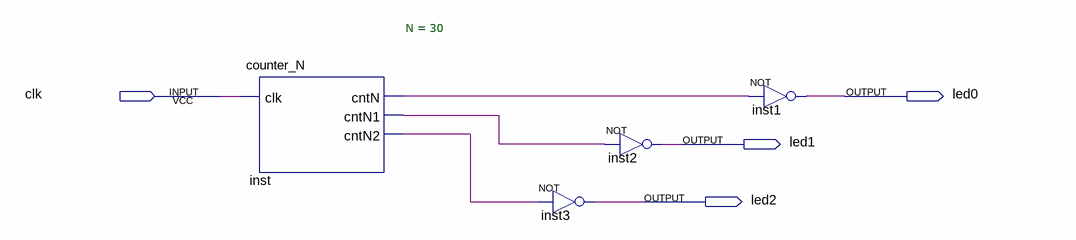
[diagram p0: schematic sheet]
// Quartus schematic test_counter_N_led0.bdf as structural Verilog: 4 symbols, 4 pins
module test_counter_N_led0 (
  input  clk,
  output led0,
  output led1,
  output led2
);

  wire inst_cntn, inst_cntn1, inst_cntn2;

  counter_N #(.N(30)) inst (.clk(clk), .cntN(inst_cntn), .cntN1(inst_cntn1), .cntN2(inst_cntn2));
  not inst3 (led2, inst_cntn2);
  not inst2 (led1, inst_cntn1);
  not inst1 (led0, inst_cntn);
endmodule
